# EAGLE design irisc (EAGLE 9.2.2)
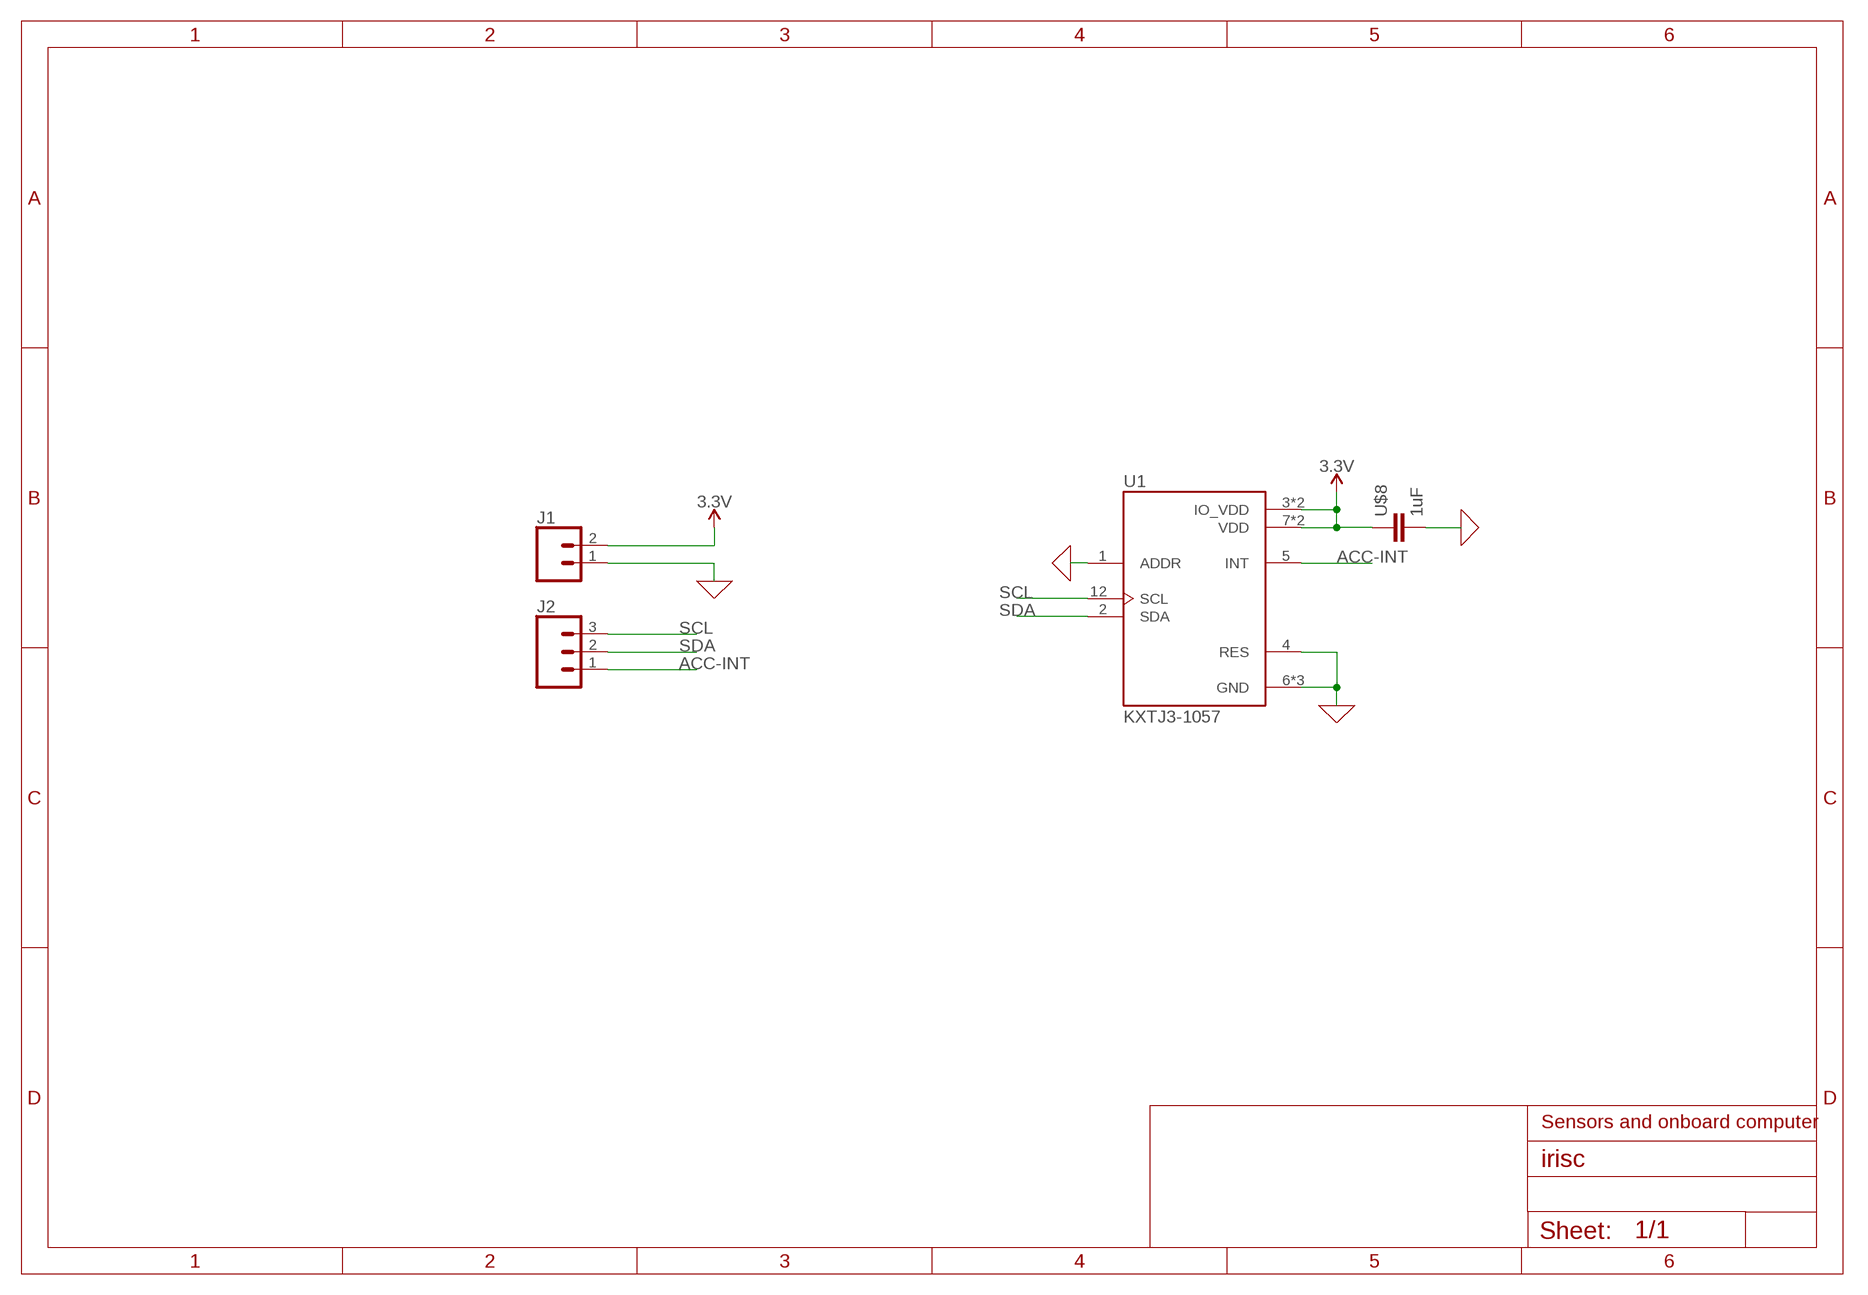
[diagram p0: schematic, sheet 1]

## Parts
J1  CONN_02  [1X02]
J2  CONN_03  [1X03]
U1  KXTJ3-1057  [KIONIX_KXTJ3-1057]
U$8  1uF  CAPACITOR_0603_N  [RESC0603_N]

## Nets
0: J1.1 U1.1(ADDR) U1.4(RES) U1.6(GND) U1.8(GND) U1.9(GND) U$8.2 ; supply symbol labelled GND
3.3V: J1.2 U1.3(IO_VDD) U1.7(VDD) U1.10(VDD) U1.11(IO_VDD) U$8.1
ACC-INT: J2.1 U1.5(INT)
SCL: J2.3 U1.12(SCL)
SDA: J2.2 U1.2(SDA)

## Notes on the sheet
- Sensors and onboard computer

## Library data of the parts
J1 = SparkFun-Connectors:CONN_02: Multi connection point. Often used as Generic Header-pin footprint for 0.1 inch spaced/style header connections On any of the 0.1 inch spaced packages, you can populate with these: Break Away Headers - Straight <https://www.sparkfun.com/products/116> (PRT-00116) Break Away Male Headers - Right Angle <https://www.sparkfun.com/products/553> (PRT-00553) Female Headers <https://www.sparkfun.com/products/115> (PRT-00115) Break Away Headers - Machine Pin <https://www.sparkfun.com/products/117> (PRT-00117) Break Away Female Headers - Swiss Machine Pin <https://www.sparkfun.com/products/743> (PRT-00743) For SCREWTERMINALS and SPRING TERMINALS visit here: Screw Terimnals on SparkFun.com <https://www.sparkfun.com/search/results?term=Screw+Terminals> (5mm/3.5mm/2.54mm spacing) This device is also useful as a general connection point to wire up your design to another part of your project. Our various solder wires solder well into these plated through hole pads. Hook-Up Wire - Assortment (Stranded, 22 AWG) <https://www.sparkfun.com/products/11375> (PRT-11375) Hook-Up Wire - Assortment (Solid Core, 22 AWG) <https://www.sparkfun.com/products/11367> (PRT-11367) View the entire wire category on our website here <https://www.sparkfun.com/categories/141> Special notes: Molex polarized connector foot print use with: PRT-08233 with associated crimp pins and housings. 2.54_SCREWTERM for use with PRT-10571. 3.5mm Screw Terminal footprints for PRT-08084 5mm Screw Terminal footprints for use with PRT-08432
J2 = SparkFun-Connectors:CONN_03: Multi connection point. Often used as Generic Header-pin footprint for 0.1 inch spaced/style header connections On any of the 0.1 inch spaced packages, you can populate with these: Break Away Headers - Straight <https://www.sparkfun.com/products/116> (PRT-00116) Break Away Male Headers - Right Angle <https://www.sparkfun.com/products/553> (PRT-00553) Female Headers <https://www.sparkfun.com/products/115> (PRT-00115) Break Away Headers - Machine Pin <https://www.sparkfun.com/products/117> (PRT-00117) Break Away Female Headers - Swiss Machine Pin <https://www.sparkfun.com/products/743> (PRT-00743) Stackable Header - 3 Pin (Female, 0.1") <https://www.sparkfun.com/products/13875> (PRT-13875) For SCREWTERMINALS and SPRING TERMINALS visit here: Screw Terimnals on SparkFun.com <https://www.sparkfun.com/search/results?term=Screw+Terminals> (5mm/3.5mm/2.54mm spacing) This device is also useful as a general connection point to wire up your design to another part of your project. Our various solder wires solder well into these plated through hole pads. Hook-Up Wire - Assortment (Stranded, 22 AWG) <https://www.sparkfun.com/products/11375> (PRT-11375) Hook-Up Wire - Assortment (Solid Core, 22 AWG) <https://www.sparkfun.com/products/11367> (PRT-11367) View the entire wire category on our website here <https://www.sparkfun.com/categories/141> Special notes: Molex polarized connector foot print use with SKU : PRT-08232 with associated crimp pins and housings.
U1 = KXTJ3-1057:KXTJ3-1057: Mems Accelerometer, 2G/4G/8G, Lga-12; AVAILABILITY: Unavailable; DESCRIPTION: Mems Accelerometer, 2G/4G/8G, Lga-12; MF: Kionix Inc.; MP: KXTJ3-1057; PACKAGE: LGA-12 Kionix; PRICE: None
U$8 = Nordic_nRF:CAPACITOR: Generic chip capacitor

## Board
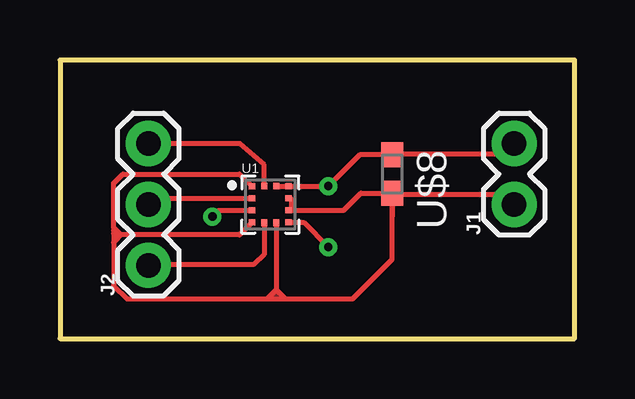
[diagram p1: board, top side]
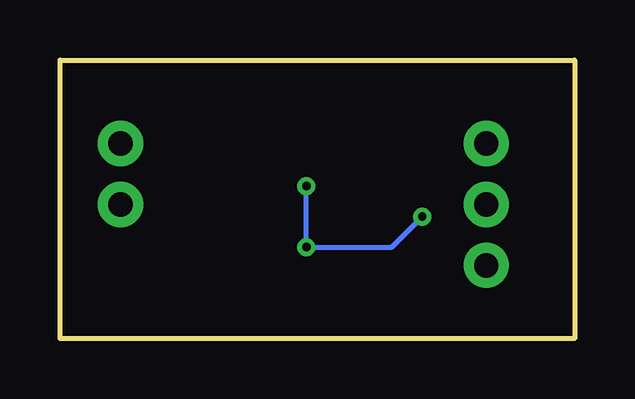
[diagram p2: board, bottom side, seen from below]

Size 21.44 x 11.61 mm. Coordinates in mm from the lower left corner, seen from the top.
Outline: 0,0 21.44,0 21.44,11.61 0,11.61 0,0
Copper layers (1*16): Top 0.035mm / dielectric 1.5mm / Bottom 0.035mm
Design rules "default": minimum track width 6mil, minimum drill 0.35mm, track to track 6mil, track to pad 6mil, pad to pad 6mil, via to via 6mil, smd to smd 6mil, copper to edge 40mil, drill to drill 6mil, minimum pad ring 10mil, minimum via ring 8mil, stop-mask expansion 4mil, vias tented up to drill 0mil, thermal gap 10mil

### Footprints (pad centres in the part's own frame; a part is rotated, then mirrored left to right if it is on the bottom)
1X02 = drill 1.016 pad 1.88: 1 0,0; 2 2.54,0
1X03 = drill 1.016 pad 1.88: 1 0,0; 2 2.54,0; 3 5.08,0
KIONIX_KXTJ3-1057 = smd 0.275 x 0.25: 1 -0.762,0.75; 2 -0.762,0.25; 3 -0.762,-0.25; 4 -0.762,-0.75; 7 0.762,-0.75; 8 0.762,-0.25; 9 0.762,0.25; 10 0.762,0.75 | smd 0.25 x 0.275: 5 -0.25,-0.762; 6 0.25,-0.762; 11 0.25,0.762; 12 -0.25,0.762
RESC0603_N = smd 1.05 x 0.9: 1 -0.8,0; 2 0.8,0

### Placement (x,y rotation side)
J1  18.92,5.59 90 top
J2  3.68,3.05 90 top
U1  8.76,5.59 0 top
U$8  13.84,6.86 270 top

### Tracks (layer width: path | path; a pad name or v marks a point on that pad's centre or on a via)
0
  Top 0.2: U1.9 9.63,5.84 9.63,5.38 U1.8 11.81,5.34 12.54,6.06 U$8.2 | 13.71,5.84 U$8.2 | 9.02,4.78 U1.6 | 7.95,4.78 U1.4 7.48,4.32 2.54,4.32 | U$8.2 13.89,5.99 18.57,5.99 18.87,5.69 J1.1 | U$8.2 13.84,5.08 | U1.6 9.01,3.69 | U$8.2 13.84,3.3 12.19,1.65 9.5,1.65 9.39,1.65 | 2.54,4.32 2.23,4.62 | 2.23,4.62 2.23,6.48 2.62,6.86 7.48,6.86 U1.1 | 2.54,4.32 2.48,4.25 | 2.48,4.25 2.41,4.19 | 2.41,4.19 2.23,4.01 | 2.23,4.01 2.23,2.21 2.79,1.65 8.64,1.65 | 2.23,4.37 2.23,4.01 | 2.23,4.62 2.23,4.5 | 2.23,4.5 2.48,4.25 | 2.23,4.5 2.23,4.37 | 2.23,4.37 2.41,4.19 | U1.6 9.01,2.03 | 9.01,2.03 8.64,1.65 | 8.64,1.65 9.39,1.65 | 9.01,2.03 9.39,1.65
  pour Top: 9,2 8.76,1.76 8.76,1.65 9.14,1.65 9.14,1.91 9.02,2.03 arc90 9,2.02
3.3V  (via drill 0.35)
  Top 0.152: U1.11 arc90 9.03,6.34
  Top 0.2: 19.02,8.13 J1.2 18.87,8.13 18.41,7.67 13.89,7.67 U$8.1 12.5,7.66 11.18,6.34 | 11.18,6.34 U1.10 9.03,6.34 arc-90 U1.11 | 11.18,6.34 v11.18,6.35 | U1.7 10.15,4.84 v11.18,3.81 | v6.35,5.08 6.61,5.34 U1.3
  Bottom 0.2: v11.18,6.35 v11.18,3.81 7.62,3.81 v6.35,5.08
ACC-INT
  Top 0.2: J2.1 3.73,3.1 8.1,3.1 8.5,3.5 8.5,4.81 arc-90 U1.5
SCL
  Top 0.2: U1.12 8.51,7.24 7.49,8.13 J2.3
SDA
  Top 0.2: U1.2 7.95,5.84 3.89,5.84 3.73,5.69 J2.2